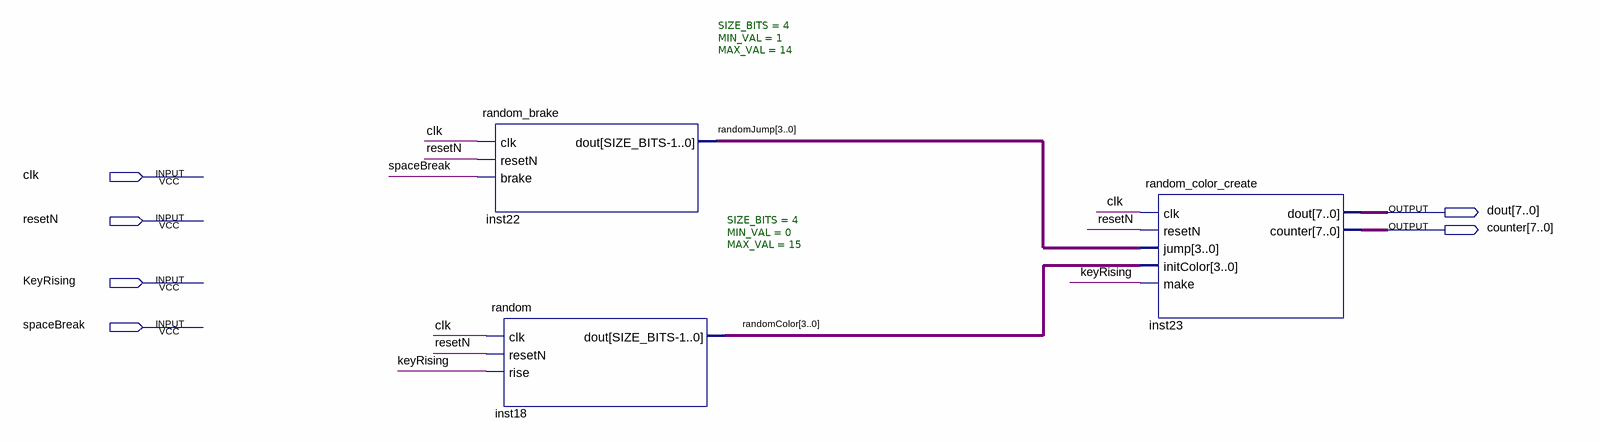
[diagram p0: schematic sheet]
// Quartus schematic randomColor.bdf as structural Verilog: 3 symbols, 6 pins
module randomColor (
  input  clk,
  input  resetN,
  input  KeyRising,
  input  spaceBreak,
  output [7:0] dout,
  output [7:0] counter
);

  wire [3:0] randomColor, randomJump;

  random_brake #(.SIZE_BITS(4), .MIN_VAL(1), .MAX_VAL(14)) inst22 (
    .clk(clk), .resetN(resetN), .brake(spaceBreak), .dout(randomJump));
  random #(.SIZE_BITS(4), .MIN_VAL(0), .MAX_VAL(15)) inst18 (
    .clk(clk), .resetN(resetN), .rise(KeyRising), .dout(randomColor));
  random_color_create inst23 (
    .clk(clk), .resetN(resetN), .jump(randomJump), .initColor(randomColor), .make(KeyRising), .dout(dout),
    .counter(counter));
endmodule
